# EAGLE design rev11 (EAGLE 7.4.0)
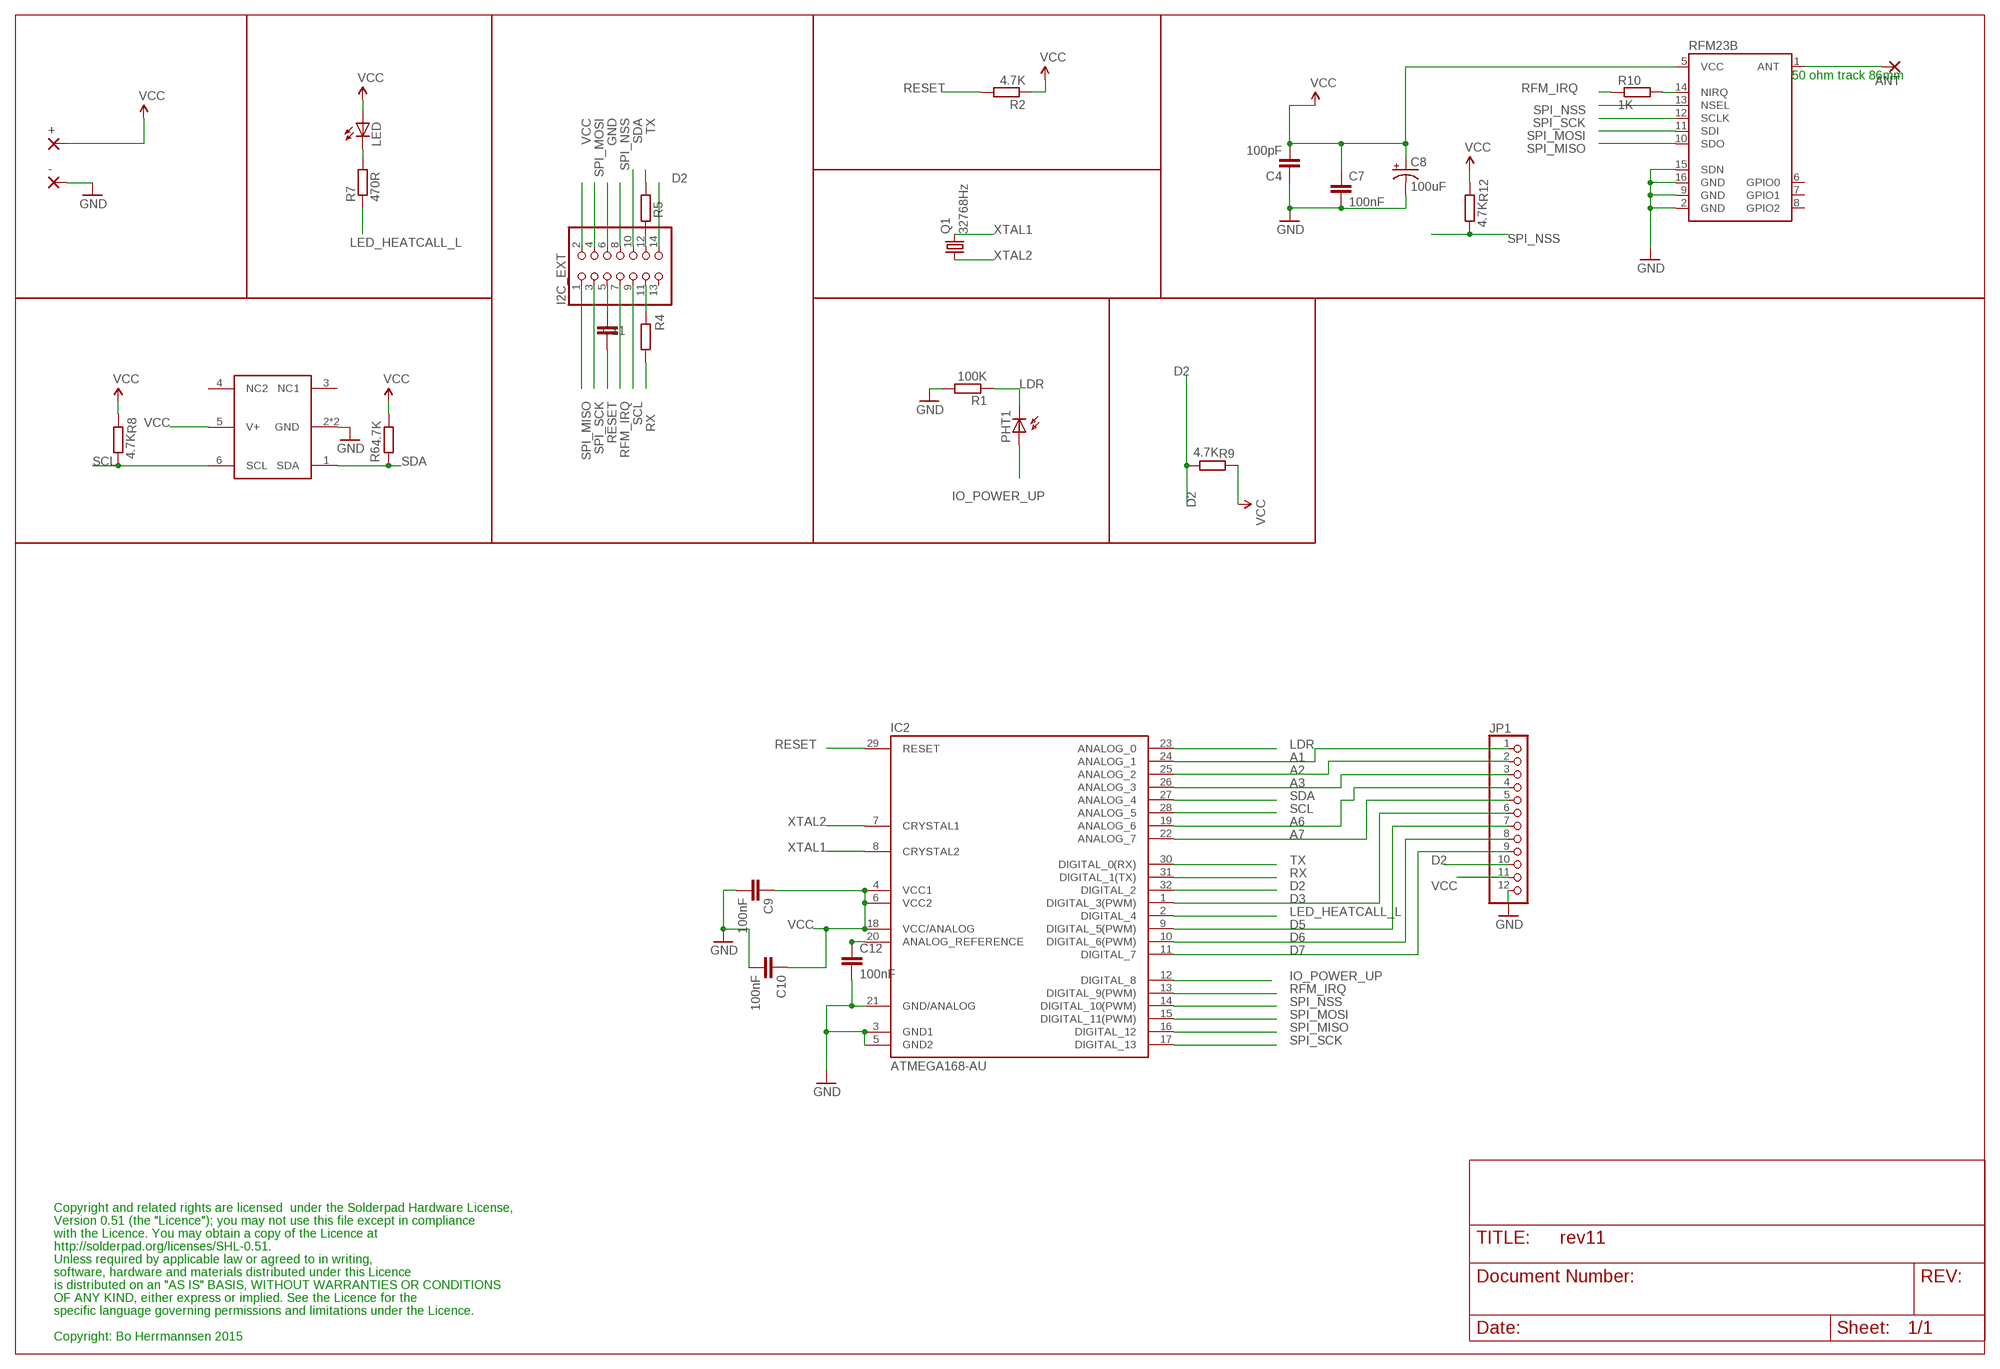
[diagram p0: schematic, sheet 1]

## Parts
+  2,15/1,0  [2,15/1,0]
-  2,15/1,0  [2,15/1,0]
ANT  SMD2  [SMD1,27-2,54]
C4  100pF  C-EUC0603  [C0603]
C7  100nF  C-EUC0603  [C0603]
C8  100uF  CAP_POL1206  [EIA3216]
C9  100nF  C-EUC0603  [C0603]
C10  100nF  C-EUC0603  [C0603]
C11  100nF  C-EUC0603  [C0603]
C12  100nF  C-EUC0603  [C0603]
I2C_EXT  PINHD-2X7  [2X07]
IC2  ATMEGA168-AU  [TQFP32-08]
JP1  PINHD-1X12  [1X12]
LED  LEDCHIPLED_0603  [CHIPLED_0603]
PHT1  BPX65  [BPX65]
Q1  32768Hz  MC-306  [MC-306]
R1  100K  R-EU_R0603  [R0603]
R2  4.7K  R-EU_R0603  [R0603]
R4  4.7K  R-EU_R0603  [R0603]
R5  4.7K  R-EU_R0603  [R0603]
R6  4.7K  R-EU_R0603  [R0603]
R7  470R  R-EU_R0603  [R0603]
R8  4.7K  R-EU_R0603  [R0603]
R9  4.7K  R-EU_R0603  [R0603]
R10  1K  R-EU_R0603  [R0603]
R12  4.7K  R-EU_R0603  [R0603]
RFM23B  RFM23B  [RFM23-XXX-S1]
U$4  SHT21  [SHT21]

## Nets
A1: IC2.24(ANALOG_1) JP1.1
A2: IC2.25(ANALOG_2) JP1.2
A3: IC2.26(ANALOG_3) JP1.3
A6: IC2.19(ANALOG_6) JP1.4
A7: IC2.22(ANALOG_7) JP1.5
D2: I2C_EXT.14 IC2.32(DIGITAL_2) JP1.10 R9.1
D3: IC2.1(DIGITAL_3(PWM)) JP1.6
D5: IC2.9(DIGITAL_5(PWM)) JP1.7
D6: IC2.10(DIGITAL_6(PWM)) JP1.8
D7: IC2.11(DIGITAL_7) JP1.9
GND [supply]: -.1(P) C4.1 C7.2 C8.C(-) C9.2 C10.2 C12.2 I2C_EXT.6 IC2.3(GND1) IC2.5(GND2) IC2.21(GND/ANALOG) JP1.12 R1.2 RFM23B.2(GND) RFM23B.9(GND) RFM23B.15(SDN) RFM23B.16(GND) U$4.2(GND) U$4.P$1(GND)
IO_POWER_UP [supply]: IC2.12(DIGITAL_8) PHT1.A
LDR: IC2.23(ANALOG_0) PHT1.K(C) R1.1
LED_HEATCALL_L: IC2.2(DIGITAL_4) R7.1
N$1: C11.2 I2C_EXT.5
N$3: I2C_EXT.12 R5.2
N$4: I2C_EXT.11 R4.2
N$6 [supply]: C12.1 IC2.20(ANALOG_REFERENCE)
N$7: R10.2 RFM23B.14(NIRQ)
N$13: LED.C R7.2
N$31 [ant]: ANT.1(P) RFM23B.1(ANT)
RESET: C11.1 IC2.29(RESET) R2.2
RFM_IRQ: I2C_EXT.7 IC2.13(DIGITAL_9(PWM)) R10.1
RX: IC2.31(DIGITAL_1(TX)) R4.1
SCL: I2C_EXT.9 IC2.28(ANALOG_5) R8.1 U$4.6(SCL)
SDA: I2C_EXT.10 IC2.27(ANALOG_4) R6.2 U$4.1(SDA)
SPI_MISO: I2C_EXT.1 IC2.16(DIGITAL_12) RFM23B.10(SDO)
SPI_MOSI: I2C_EXT.4 IC2.15(DIGITAL_11(PWM)) RFM23B.11(SDI)
SPI_NSS: I2C_EXT.8 IC2.14(DIGITAL_10(PWM)) R12.1 RFM23B.13(NSEL)
SPI_SCK: I2C_EXT.3 IC2.17(DIGITAL_13) RFM23B.12(SCLK)
TX: IC2.30(DIGITAL_0(RX)) R5.1
VCC [supply]: +.1(P) C4.2 C7.1 C8.A(+) C9.1 C10.1 I2C_EXT.2 IC2.4(VCC1) IC2.6(VCC2) IC2.18(VCC/ANALOG) JP1.11 LED.A R2.1 R6.1 R8.2 R9.2 R12.2 RFM23B.5(VCC) U$4.5(V+)
XTAL1: IC2.8(CRYSTAL2) Q1.4
XTAL2: IC2.7(CRYSTAL1) Q1.1
Unconnected: I2C_EXT.13 RFM23B.6(GPIO0) RFM23B.7(GPIO1) RFM23B.8(GPIO2) U$4.3(NC1) U$4.4(NC2)

## Notes on the sheet
- 50 ohm track 86mm
- Copyright and related rights are licensed  under the Solderpad Hardware License,
- Version 0.51 (the "Licence"); you may not use this file except in compliance
- with the Licence. You may obtain a copy of the Licence at
- http://solderpad.org/licenses/SHL-0.51.
- Unless required by applicable law or agreed to in writing,
- software, hardware and materials distributed under this Licence
- is distributed on an "AS IS" BASIS, WITHOUT WARRANTIES OR CONDITIONS
- OF ANY KIND, either express or implied. See the Licence for the
- specific language governing permissions and limitations under the Licence.
- Copyright: Bo Herrmannsen 2015

## Library data of the parts
+ - = wirepad:2,15/1,0: THROUGH-HOLE PAD
ANT = wirepad:SMD2: SMD PAD
C4 C7 C9-C12 = resistor:C-EU: CAPACITOR, European symbol
C8 = SparkFun-Passives:CAP_POL: Capacitor Polarized These are standard SMD and PTH capacitors. Normally 10uF, 47uF, and 100uF in electrolytic and tantalum varieties. Always verify the external diameter of the through hole cap, it varies with capacity, voltage, and manufacturer. The EIA devices should be standard.
I2C_EXT = pinhead:PINHD-2X7: PIN HEADER
IC2 = Arduino-AVR:ATMEGA168
JP1 = pinhead:PINHD-1X12: PIN HEADER
LED = adafruit:LED: LED OSRAM: - CHIPLED LG R971, LG N971, LY N971, LG Q971, LY Q971, LO R971, LY R971 LH N974, LH R974 LS Q976, LO Q976, LY Q976 LO Q996 - Hyper CHIPLED LW Q18S LB Q993, LB Q99A, LB R99A - SideLED LS A670, LO A670, LY A670, LG A670, LP A670 LB A673, LV A673, LT A673, LW A673 LH A674 LY A675 LS A676, LA A676, LO A676, LY A676, LW A676 LS A679, LY A679, LG A679 - Hyper Micro SIDELED® LS Y876, LA Y876, LO Y876, LY Y876 LT Y87S - SmartLED LW L88C, LW L88S LB L89C, LB L89S, LG L890 LS L89K, LO L89K, LY L89K LS L896, LA L896, LO L896, LY L896 - TOPLED LS T670, LO T670, LY T670, LG T670, LP T670 LSG T670, LSP T670, LSY T670, LOP T670, LYG T670 LG T671, LOG T671, LSG T671 LB T673, LV T673, LT T673, LW T673 LH T674 LS T676, LA T676, LO T676, LY T676, LB T676, LH T676, LSB T676, LW T676 LB T67C, LV T67C, LT T67C, LS T67K, LO T67K, LY T67K, LW E67C LS E67B, LA E67B, LO E67B, LY E67B, LB E67C, LV E67C, LT E67C LW T67C LS T679, LY T679, LG T679 LS T770, LO T770, LY T770, LG T770, LP T770 LB T773, LV T773, LT T773, LW T773 LH T774 LS E675, LA E675, LY E675, LS T675 LS T776, LA T776, LO T776, LY T776, LB T776 LHGB T686 LT T68C, LB T68C - Hyper Mini TOPLED® LB M676 - Mini TOPLED Santana® LG M470 LS M47K, LO M47K, LY M47K Source: http://www.osram.convergy.de/
PHT1 = opto-trans-siemens:BPX65: PHOTO DIODE; MPN: BPX65.; OC_FARNELL: 327451; OC_NEWARK: 06WX2764
Q1 = crystal:MC-306: kHz RANGE CRYSTAL UNIT SMD Source: MC-306_405_406_E07X.PDF Homepage <http://www.epsontoyocom.co.jp>; MPN: MC-306 60.0KHZ 100PPM ,12.5PF; OC_FARNELL: 1278040; OC_NEWARK: 31M5576
R1 R2 R4-R10 R12 = resistor:R-EU_: RESISTOR, European symbol
RFM23B = SparkFun-RF:RFM23B
U$4 = SHT21:SHT21: Tempsensor RS No: 709-8868 MRF No: TMP112AIDRLT

## Net classes
0 default: width 0.203 mm
1 supply: width 0.5 mm, clearance 0.203 mm
2 ant: width 2.184 mm

## Board
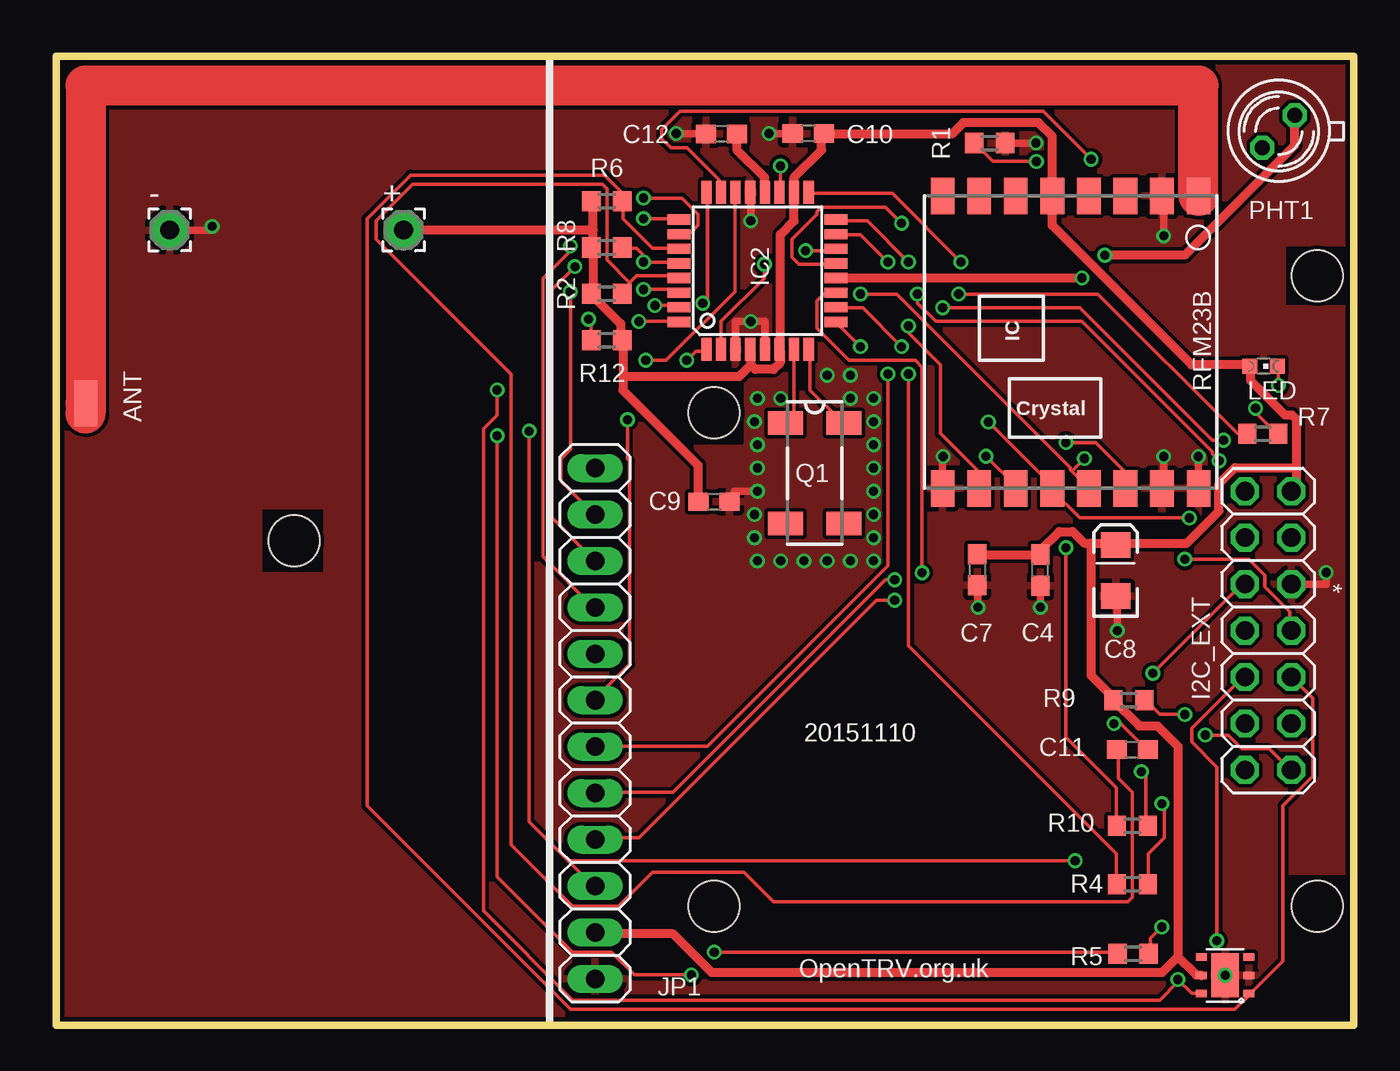
[diagram p1: board, top side]
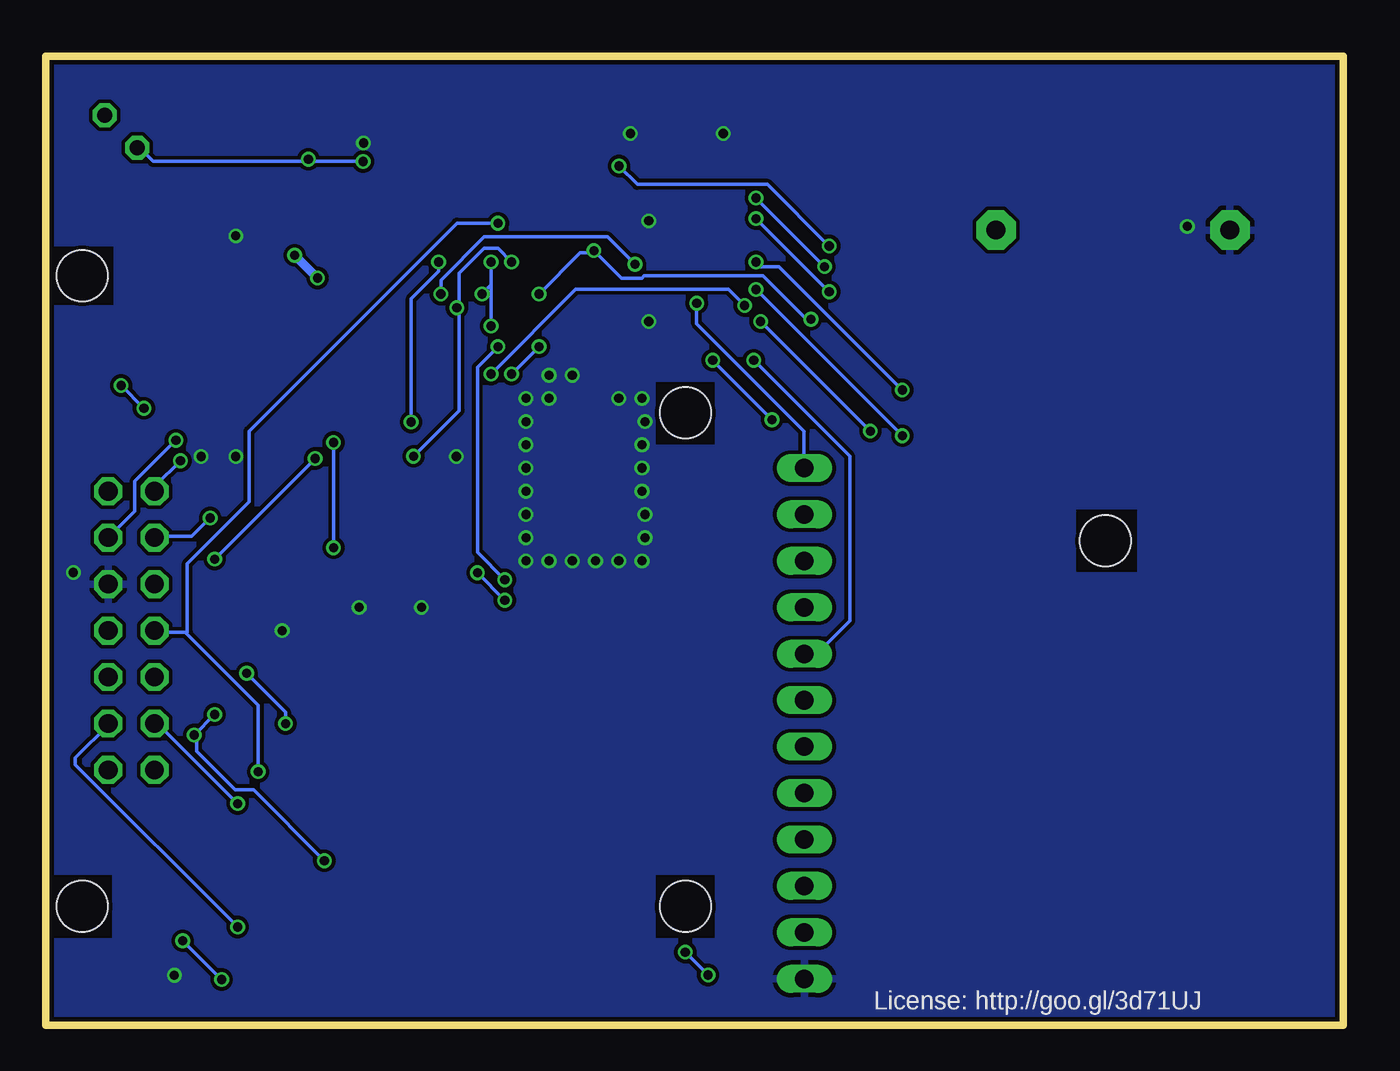
[diagram p2: board, bottom side, seen from below]

Size 71 x 53 mm. Coordinates in mm from the lower left corner, seen from the top.
Outline: 0,53 0,0 71,0 71,53 0,53
Copper layers (1*16): Top 0.035mm / dielectric 1.5mm / Bottom 0.035mm
Design rules "PMServicesStd *": minimum track width 8mil, minimum drill 0.5mm, track to track 8mil, track to pad 8mil, pad to pad 8mil, via to via 8mil, smd to smd 0mil, copper to edge 10mil, drill to drill 10mil, minimum pad ring 10mil, minimum via ring 6mil, stop-mask expansion 2mil, vias tented up to drill 100mil, thermal gap 10mil
Holes 2.8 mm at 13,26.5 36,6.5 69,41 69,6.5 36,33.5
tRestrict: area 11.3,24.8 to 14.6,28.2; area 67.4,4.8 to 70.6,8.2; area 67.3,39.4 to 70.7,42.6; area 34.4,31.8 to 37.6,35.2; area 34.4,4.8 to 37.6,8.2
bRestrict: area 11.3,24.8 to 14.6,28.2; area 34.4,31.8 to 37.6,35.2; area 34.4,4.8 to 37.6,8.2; area 67.4,4.8 to 70.6,8.2; area 67.3,39.4 to 70.7,42.6

### Footprints (pad centres in the part's own frame; a part is rotated, then mirrored left to right if it is on the bottom)
2,15/1,0 = drill 1.016 pad 2.159 octagon: 1 0,0
SMD1,27-2,54 = smd 1.27 x 2.54: 1 0,0
C0603 = smd 1.1 x 1: 1 -0.85,0; 2 0.85,0
EIA3216 = smd 1.4 x 1.6: A 1.4,0; C -1.4,0
2X07 = drill 1.016 octagon: 1 -7.62,-1.27; 2 -7.62,1.27; 3 -5.08,-1.27; 4 -5.08,1.27; 5 -2.54,-1.27; 6 -2.54,1.27; 7 0,-1.27; 8 0,1.27; 9 2.54,-1.27; 10 2.54,1.27; 11 5.08,-1.27; 12 5.08,1.27; 13 7.62,-1.27; 14 7.62,1.27
TQFP32-08 = smd 1.27 x 0.559: 1 -4.293,2.8; 2 -4.293,2; 3 -4.293,1.2; 4 -4.293,0.4; 5 -4.293,-0.4; 6 -4.293,-1.2; 7 -4.293,-2; 8 -4.293,-2.8; 17 4.293,-2.8; 18 4.293,-2; 19 4.293,-1.2; 20 4.293,-0.4; 21 4.293,0.4; 22 4.293,1.2; 23 4.293,2; 24 4.293,2.8 | smd 0.559 x 1.27: 9 -2.8,-4.293; 10 -2,-4.293; 11 -1.2,-4.293; 12 -0.4,-4.293; 13 0.4,-4.293; 14 1.2,-4.293; 15 2,-4.293; 16 2.8,-4.293; 25 2.8,4.293; 26 2,4.293; 27 1.2,4.293; 28 0.4,4.293; 29 -0.4,4.293; 30 -1.2,4.293; 31 -2,4.293; 32 -2.8,4.293
1X12 = drill 1.016 long: 1 -13.97,0; 2 -11.43,0; 3 -8.89,0; 4 -6.35,0; 5 -3.81,0; 6 -1.27,0; 7 1.27,0; 8 3.81,0; 9 6.35,0; 10 8.89,0; 11 11.43,0; 12 13.97,0
CHIPLED_0603 = smd 0.8 x 0.8: A 0,-0.75; C 0,0.75
BPX65 = drill 0.813 octagon: A -0.889,-0.889; K 0.889,0.889
MC-306 = smd 1.3 x 1.9: 1 -2.75,-1.6; 2 2.75,-1.6; 3 2.75,1.6; 4 -2.75,1.6
R0603 = smd 1 x 1.1: 1 -0.85,0; 2 0.85,0
RFM23-XXX-S1 = smd 2 x 1.3: 1 -8,7; 2 -8,5; 3 -8,3; 4 -8,1; 5 -8,-1; 6 -8,-3; 7 -8,-5; 8 -8,-7; 9 8,-7; 10 8,-5; 11 8,-3; 12 8,-1; 13 8,1; 14 8,3; 15 8,5; 16 8,7
SHT21 = smd 0.4 x 0.6: 1 -1,-1.3; 2 0,-1.3; 3 1,-1.3; 4 1,1.3; 5 0,1.3; 6 -1,1.3 | smd 2.4 x 1.5: P$1 0,0

### Placement (x,y rotation side)
+  19,43.5 0 top
-  6.2,43.5 0 top
ANT  1.6,34.02 0 top
C4  53.85,24.9 90 top
C7  50.39,24.91 270 top
C8  57.97,24.88 90 top
C9  35.99,28.64 0 top
C10  41.14,48.78 180 top
C11  58.88,15.08 0 top
C12  36.39,48.76 180 top
I2C_EXT  66.31,21.59 270 top
IC2  38.37,41.27 90 top
JP1  29.48,16.51 270 top
LED  66.06,36.05 270 top
PHT1  66.89,48.9 180 top
Q1  41.5,30.2 270 top
R1  51.07,48.26 0 top
R2  30.11,40.01 0 top
R4  58.88,7.72 0 top
R5  58.92,3.91 0 top
R6  30.11,45.09 0 top
R7  66.02,32.35 0 top
R8  30.11,42.55 180 top
R9  58.69,17.78 180 top
R10  58.88,10.91 180 top
R12  30.11,37.47 0 top
RFM23B  55.5,37.37 270 top
U$1  [OSHW_10X200_NOTEXT]  75.9,21.11 0 top  (outside the outline)
U$2  [TONNE]  81.42,4.86 0 top  (outside the outline)
U$4  63.96,2.73 90 top

### Tracks (layer width: path | path; a pad name or v marks a point on that pad's centre or on a via)
A1  (via drill 0.5)
  Top 0.203: v35.38,39.5 35.62,39.75 35.62,45.5 IC2.24
  Bottom 0.203: v35.38,39.5 35.38,38.38 29.5,32.5 29.5,30.5 JP1.1
A2  (via drill 0.5)
  Top 0.203: v32.12,44.12 34,44.12 IC2.25 | v28.12,40.12 28.12,31.5 27.62,31 27.62,29.75 29.38,28 JP1.2
  Bottom 0.203: v28.12,40.12 v32.12,44.12
A3  (via drill 0.5)
  Top 0.203: v32.12,45.25 34.25,45.25 35.12,44.38 35.12,43.75 34.75,43.38 34.12,43.38 IC2.26 | v28.38,41.5 27.12,40.25 27.12,27.75 29.38,25.5 JP1.3
  Bottom 0.203: v28.38,41.5 v32.12,45.25
A6  (via drill 0.5)
  Top 0.203: v39.62,47 39.62,45.62 IC2.19 | v28.12,42.62 28.12,42.38 26.62,40.88 26.62,25.62 29.38,22.88 JP1.4
  Bottom 0.203: v39.62,47 38.62,46 31.5,46 v28.12,42.62
A7  (via drill 0.5)
  Top 0.203: v32.25,36.38 33.38,36.38 37.12,40.12 37.12,45.5 IC2.22
  Bottom 0.203: v32.25,36.38 27,31.12 27,22.12 28.75,20.38 29.38,20.38 JP1.5
D2  (via drill 0.5)
  Top 0.203: v61.75,17 60.38,17 59.62,17.75 R9.1 | v62.88,15.88 64.12,15.88 64.88,15.12 66.38,15.12 67.5,14 I2C_EXT.14 | v31.88,38.5 34,38.5 IC2.32 | v25.88,32.5 25.88,11.12 28.06,8.94 | 28.06,8.94 29.38,7.62 JP1.10 | v55.75,9 28.12,9 28.06,8.94
  Bottom 0.203: v61.75,17 v62.88,15.88 62.75,15.88 62.75,15 60.62,12.88 59.62,12.88 v55.75,9 | v25.88,32.5 v31.88,38.5
D3  (via drill 0.5)
  Top 0.203: v34.5,36.38 35,36.88 35.5,36.88 IC2.1 | v31.25,33.12 31.25,31 31.38,30.88 31.38,19.75 29.5,17.88 JP1.6
  Bottom 0.203: v31.25,33.12 v34.5,36.38
D5  (via drill 0.5)
  Top 0.203: v44,37.12 42.75,38.38 IC2.9 | v45.5,35.62 45.5,25.12 35.62,15.25 29.5,15.25 JP1.7
  Bottom 0.203: v45.5,35.62 v44,37.12
D6  (via drill 0.5)
  Top 0.203: v46.25,37.12 44.12,39.25 42.75,39.25 IC2.10 | v45.88,24.38 45.38,24.38 33.75,12.75 29.5,12.75 JP1.8
  Bottom 0.203: v46.25,37.12 47.38,36 47.38,25.88 v45.88,24.38
D7  (via drill 0.5)
  Top 0.203: v47.38,24.75 47.38,36 47,36.38 43.38,36.38 41.62,38.12 41.62,39.62 42,40 42.62,40 IC2.11 | v45.88,23.25 44.88,23.25 31.88,10.25 29.5,10.25 JP1.9
  Bottom 0.203: v45.88,23.25 v47.38,24.75
GND  (via drill 0.5)
  Top 0.406: C4.1 v53.85,22.86 | C7.2 50.44,24.06 v50.44,22.86 | C8.C 58.05,23.48 v58.05,21.59 | v39.01,48.78 C10.2 | C12.2 33.92,48.76 v33.92,48.78 | v48.53,31.11 48.5,31.11 RFM23B.9 | IC2.21 38,45.57 v38,44 | IC2.5 38.77,38.5 v38,38.5 37.17,38.5 IC2.3 | C9.2 37.1,29.21 v38.37,29.21 | R1.2 v53.61,48.26 | RFM23B.2 60.59,45.37 v60.59,43.18 | RFM23B.16 v62.5,31.11 | RFM23B.15 60.59,29.36 v60.59,31.11 | I2C_EXT.6 69.48,24.13 v69.48,24.77 | -.1 8.53,43.5 v8.53,43.7
  other vias: 44.72,30.48 44.72,31.75 44.72,33.02 44.72,34.29 43.45,34.29 43.45,35.56 42.18,35.56 39.64,34.29 38.37,34.29 38.2,33.02 38.37,31.75 38.37,30.48 38.2,27.94 38.2,26.67 38.37,25.4 39.64,25.4 40.91,25.4 42.18,25.4 43.45,25.4 44.72,25.4 44.72,26.67 44.72,27.94 44.72,29.21 63.96,2.73
  pour Top: 0,0 71,0 71,53 0,53
  pour Bottom: 0,0 71,0 71,53 0,53
IO_POWER_UP  (via drill 0.5)
  Top 0.5: v56.12,40.88 IC2.12 | v57.38,42.12 61.75,42.12 67.75,48.12 67.75,49.75 PHT1.A
  Bottom 0.5: v57.38,42.12 v56.12,40.88
LDR  (via drill 0.5)
  Top 0.203: v53.62,47.25 51.25,47.25 50.25,48.25 R1.1 | v56.62,47.38 54,50 34.12,50 33.12,49 33.12,48.5 33.62,48 34.5,48 36.25,46.25 36.25,45.62 IC2.23
  Bottom 0.203: 56.62,47.25 65.12,47.25 66,48.12 PHT1.K | 56.62,47.25 v53.62,47.25 | 56.62,47.25 v56.62,47.38
LED_HEATCALL_L  (via drill 0.5)
  Top 0.203: v49.38,40 57,40 64.62,32.38 65.12,32.38 R7.1 | v38.75,41.62 38.75,40.88 36.38,38.5 36.38,37 IC2.2
  Bottom 0.203: v49.38,40 49.38,40.75 47,43.12 40.25,43.12 v38.75,41.62
N$1  (via drill 0.5)
  Top 0.203: v57.88,16.5 58.25,16.5 59.62,15.12 C11.2 | v60,19.25 65,24.25 I2C_EXT.5
  Bottom 0.203: v57.88,16.5 57.88,17.12 v60,19.25
N$3  (via drill 0.5)
  Top 0.203: v60.5,5.38 59.88,4.75 59.88,4 R5.2
  Bottom 0.203: v60.5,5.38 69.38,14.25 69.38,14.62 67.5,16.5 I2C_EXT.12
N$4  (via drill 0.5)
  Top 0.203: v60.5,12.12 60.62,12 60.62,10.25 59.75,9.38 59.75,7.75 R4.2
  Bottom 0.203: v60.5,12.12 65,16.62 I2C_EXT.11
N$6
  Top 0.5: C12.1 37.25,47.88 38.75,46.38 38.75,45.62 IC2.20
N$7  (via drill 0.5)
  Top 0.203: v55.25,26.12 55.25,15.75 58,13 58,11 R10.2 | v55.25,31.88 56.88,31.88 58.5,30.25 RFM23B.14
  Bottom 0.203: v55.25,31.88 v55.25,26.12
N$13  (via drill 0.5)
  Top 0.203: v66.88,35 66.88,36 LED.C | v65.62,33.75 65.62,33.5 66.75,32.38 R7.2
  Bottom 0.203: v65.62,33.75 v66.88,35
N$31
  Top 2.184: RFM23B.1 62.5,51.4 1.6,51.4 ANT.1 1.6,33.47
RESET
  Top 0.203: 31.38,40.62 31.38,40.5 31,40.12 R2.2 | 31.38,40.62 31.75,41 33.88,41 34,40.88 IC2.29 | 31.38,40.62 30.12,41.88 30.12,45.75 29.88,46 19.5,46 17.5,44 17.5,43 24.88,35.62 24.88,9.88 28.25,6.5 30.75,6.5 32.62,8.38 37.62,8.38 39.25,6.75 58.62,6.75 58.88,7 58.88,12.75 58.12,13.5 58.12,15 C11.1
RFM_IRQ  (via drill 0.5)
  Top 0.203: v59.38,13.88 59.62,13.62 59.62,11 R10.1 | v46.25,43.88 45.38,44.75 41.88,44.75 41.62,44.5 41.62,44.38 40.25,43 40.25,42 40.62,41.62 42.62,41.62 IC2.13
  Bottom 0.203: v59.38,13.88 59.38,17.5 63.31,21.44 | 63.31,21.44 63.38,21.5 65,21.5 I2C_EXT.7 | v46.25,43.88 48.5,43.88 59.88,32.5 59.88,28.62 63.25,25.25 63.25,21.5 63.31,21.44
RX  (via drill 0.5)
  Top 0.203: v46.62,35.62 46.62,20.75 58,9.38 58,7.75 R4.1 | v32.75,39.38 34,39.38 IC2.31
  Bottom 0.203: v46.62,35.62 42,40.25 33.62,40.25 v32.75,39.38
SCL  (via drill 0.5)
  Top 0.203: 32.31,41.94 32.5,41.75 34,41.75 IC2.28 | 32.31,41.94 31.75,42.5 31,42.5 R8.1 | v63.5,4.62 63.5,14.12 62.12,15.5 62.12,16.25 65,19.12 I2C_EXT.9 | U$4.6 62.62,1.75 62.12,1.75 v61.38,2.5 61.38,2.38 60.38,1.38 28.25,1.38 23.38,6.25 23.38,32.62 24.12,33.38 v24.12,34.75 | v32.12,41.75 32.31,41.94
  Bottom 0.203: v63.5,4.62 v61.38,2.5 | v32.12,41.75 31.88,41.5 30.88,41.5 v24.12,34.75
SDA
  Top 0.203: IC2.27 34,42.5 32.62,42.5 31,44.12 31,45 R6.2 30.88,45.12 30.88,45.62 30,46.5 19.38,46.5 17,44.12 17,12 28.12,0.88 64.5,0.88 65.25,1.62 U$4.1 65.38,1.75 67.12,3.5 67.12,12 68.75,13.62 68.75,17.88 67.62,19 I2C_EXT.10
SPI_MISO  (via drill 0.5)
  Top 0.203: v46.62,41.75 44.38,44 42.75,44 IC2.16 | v46.62,38.25 46.62,37.88 48.38,36.12 48.38,32.38 50.5,30.25 RFM23B.10 | v63.62,30.88 63.25,31.25 63.25,31.38 56.12,38.5 48.12,38.5 47.12,39.5 v47.12,40
  Bottom 0.203: v46.62,38.25 46.62,40.5 | 46.62,40.5 v46.62,41.75 | v63.62,30.88 65,29.5 65,29.25 I2C_EXT.1 | 46.62,40.5 v47.12,40
SPI_MOSI  (via drill 0.5)
  Top 0.203: v45.5,41.75 44,43.25 42.75,43.25 IC2.15 | v50.88,31.12 52.5,29.5 RFM23B.11 | v63.88,32 63.25,32 56,39.25 v48.5,39.25
  Bottom 0.203: v45.5,41.75 46.25,42.5 47,42.5 48.38,41.12 48.38,39.25 | 48.38,39.25 48.38,33.62 v50.88,31.12 | I2C_EXT.4 66.12,28.12 66.12,29.75 v63.88,32 | 48.38,39.25 v48.5,39.25
SPI_NSS  (via drill 0.5)
  Top 0.203: v29.12,38.62 29.25,38.5 29.25,37.5 R12.1 | v41,42.38 42.62,42.38 IC2.14 | 55.56,30.31 55.5,30.38 55.5,30.5 46,40 v44,40 | 55.56,30.31 RFM23B.13 | v61.75,25.5 65.25,25.5 66.12,24.62 66.12,24 67.5,22.62 67.5,21.62 I2C_EXT.8 | 55.56,30.31 v56.25,31
  Bottom 0.203: v29.12,38.62 29.38,38.62 31.75,41 38.25,41 38.38,40.88 39.5,40.88 v41,42.38 41,42.25 41.75,42.25 v44,40 | v56.25,31 v61.75,25.5
SPI_SCK  (via drill 0.5)
  Top 0.203: v49.5,41.75 45.75,45.5 41.25,45.5 IC2.17 | v51,33 54.5,29.5 RFM23B.12 54.5,29.25 56,27.75 v62,27.75
  Bottom 0.203: v49.5,41.75 49.5,41.25 51,39.75 v51,33 | v62,27.75 63,26.75 65,26.75 I2C_EXT.3
TX  (via drill 0.5)
  Top 0.203: v36,4 58,4 R5.1 | v34.75,2.75 31.62,2.75 30.38,4 28.25,4 24.12,8.12 v24.12,32.25 | v32.12,40.25 33.88,40.25 34,40.12 IC2.30
  Bottom 0.203: v34.75,2.75 v36,4 | v32.12,40.25 v24.12,32.25
VCC
  Top 0.5: 38,36.12 38,36.88 IC2.4 | 38,36.12 38.25,35.88 39.25,35.88 39.62,36.25 39.62,36.88 IC2.6 39.62,37.12 39.62,43.25 40.38,44 40.38,45.38 IC2.18 40.38,45.62 40.38,46.38 41.88,47.88 41.88,48.75 C10.1 42.25,48.75 49,48.75 49.62,49.38 53.75,49.38 54.5,48.62 RFM23B.5 54.5,43.75 62.12,36.12 65.12,36.12 LED.A 65.38,36 65.38,35.25 67.25,33.38 67.62,33.38 67.88,33.12 67.88,30.5 | 31,35.5 31,37.25 R12.2 30.88,37.5 30.88,38.38 29.38,39.88 R2.1 29.38,40.12 29.38,42.5 R8.2 29.38,42.75 29.38,43.5 | 31,35.5 31,34.75 35.12,30.62 35.12,28.75 C9.1 | 29.38,43.5 29.38,45 R6.1 | 38,36.12 37.38,35.5 31,35.5 | 29.38,43.5 +.1 | 67.88,30.5 67.88,29.5 67.62,29.25 I2C_EXT.2 | C7.1 50.5,25.75 53.75,25.75 C4.2 53.88,26 54.88,27 55.62,27 56.25,26.38 56.62,26.38 | 56.62,26.38 57.88,26.38 C8.A 58.12,26.38 61.88,26.38 63.62,28.12 63.62,29.62 64.5,30.5 67.88,30.5 | 61.38,3.75 62.38,2.75 62.62,2.75 U$4.5 | 61.38,3.75 61.38,15.25 60.25,16.38 59.25,16.38 57.88,17.75 R9.2 57.75,18 56.62,19.12 56.62,26.38 | 61.38,3.75 60.5,2.88 35.88,2.88 33.75,5 29.5,5 JP1.11
XTAL1
  Top 0.203: IC2.8 41.25,36.88 41.25,34.75 43,33 Q1.4
XTAL2
  Top 0.203: IC2.7 40.38,36.88 40.38,33.38 40,33 Q1.1

### Text on the board
bPlace: License: http://goo.gl/3d71UJ
tNames: * | 20151110 | OpenTRV.org.uk